# EAGLE schematic LightSensitiveDCPower (EAGLE 7.1.0)
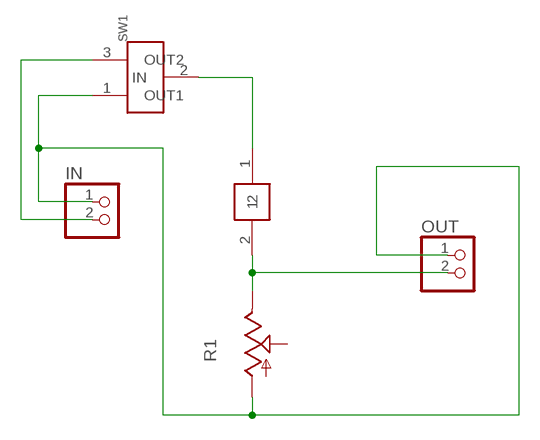
[diagram p0: schematic, sheet 1]

## Parts
IN  PINHD-1X2  [1X02]
OUT  PINHD-1X2  [1X02]
PC1  PDV-P8101  [PHOTOCELL_CERAMIC]
R1  TRIM_US-B25P  [B25P]
SW1  PCM12SMTR  [PCM12SMTR]

## Nets
N$1: IN.1 OUT.1 R1.A SW1.1(OUT1)
N$2: IN.2 SW1.3(OUT2)
N$3: PC1.1 SW1.2(IN)
N$5: OUT.2 PC1.2 R1.E
Unconnected: R1.S

## Library data of the parts
IN OUT = pinhead:PINHD-1X2: PIN HEADER
PC1 = freddyLibr:PDV-P8101: Photocell in ceramic package
R1 = pot:TRIM_US-: POTENTIOMETER
SW1 = freddyLibr:PCM12SMTR: Three pin switch. Horizontal gull wing surface mount.